# EasyEDA schematic SCH_nb_v2_2022-07-07.json
TITLE: Sheet_1; REV: 1.0; Date: 2022-05-18; Sheet: 1/1; Drawn By: LeeSophia; Company: Your Company
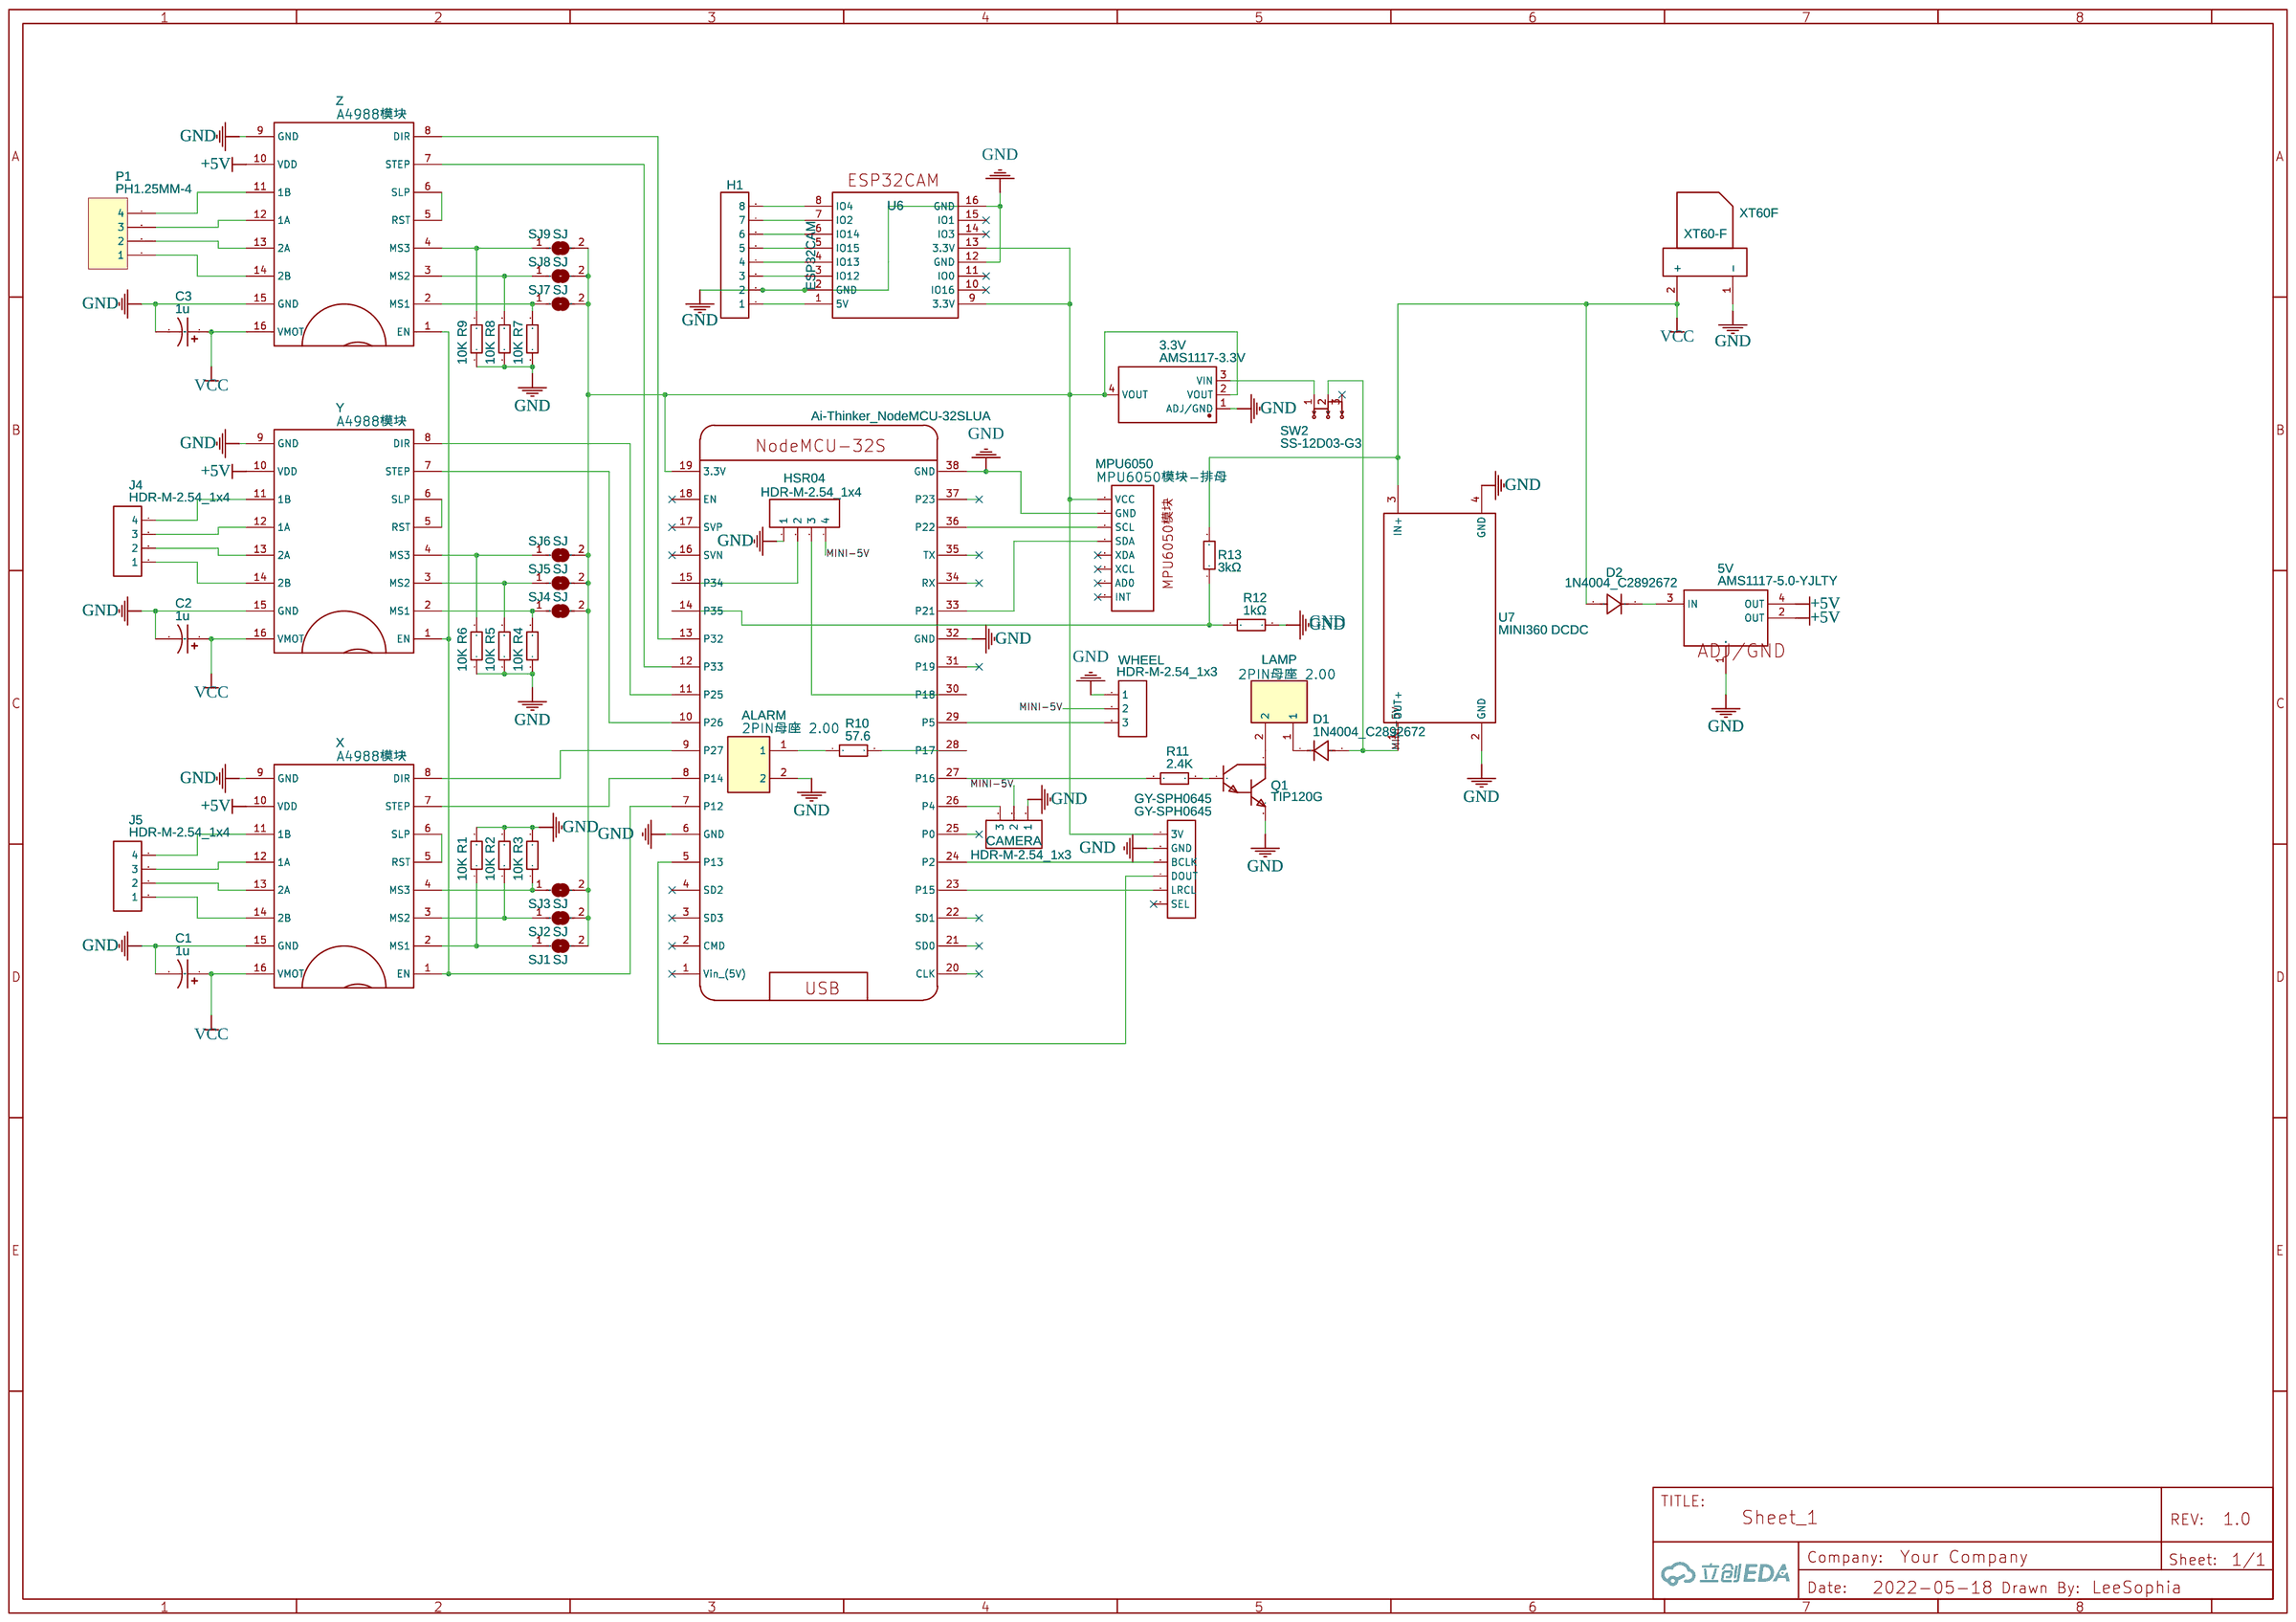
[diagram p0: schematic sheet]

## Parts
3.3V  AMS1117-3.3V  [SOT-223-4_L6.5-W3.5-P2.30-LS7.0-BR]
5V  AMS1117-5.0-YJLTY  [SOT-223-3_L6.7-W3.7-P2.30-LS7.0-BR]
ALARM  2PIN母座 2.00  [CONN-TH_2P-P2.00_PH-2A_C2319]
C1  1u  [CAP-D6.3×F2.5]
C2  1u  [CAP-D6.3×F2.5]
C3  1u  [CAP-D6.3×F2.5]
CAMERA  HDR-M-2.54_1x3  [HDR-M-2.54_1X3]
D1  1N4004_C2892672  [SMA_L4.3-W2.6-LS5.1-RD]
D2  1N4004_C2892672  [SMA_L4.3-W2.6-LS5.1-RD]
GY-SPH0645  GY-SPH0645  [HDR-F-2.54_1X6]
H1  H1  [HDR-F-2.54_1X8]
HSR04  HDR-M-2.54_1x4  [HDR-M-2.54_1X4]
J4  HDR-M-2.54_1x4  [HDR-M-2.54_1X4]
J5  HDR-M-2.54_1x4  [HDR-M-2.54_1X4]
LAMP  2PIN母座 2.00  [CONN-TH_2P-P2.00_PH-2A_C2319]
MPU6050  MPU6050模块-排母  [MPU6050模块-排母-PCB]
P1  PH1.25MM-4  [PH1.25MM-4]
Q1  TIP120G  [TO-220-3_L10.0-W4.5-P2.54-L]
R1  10K  [R0603]
R2  10K  [R0603]
R3  10K  [R0603]
R4  10K  [R0603]
R5  10K  [R0603]
R6  10K  [R0603]
R7  10K  [R0603]
R8  10K  [R0603]
R9  10K  [R0603]
R10  57.6  [R0603]
R11  2.4K  [R0603]
R12  1kΩ  [R0603]
R13  3kΩ  [R0603]
SJ1  SJ  [SJ]
SJ2  SJ  [SJ]
SJ3  SJ  [SJ]
SJ4  SJ  [SJ]
SJ5  SJ  [SJ]
SJ6  SJ  [SJ]
SJ7  SJ  [SJ]
SJ8  SJ  [SJ]
SJ9  SJ  [SJ]
SW2  SS-12D03-G3  [SW-TH_SS-12D03-G3]
U2  Ai-Thinker_NodeMCU-32SLUA  [AI-THINKER_NODEMCU-32SLUA]
U6  ESP32CAM  [ESP32CAMPCB]
U7  MINI360 DCDC  [MINI360]
WHEEL  HDR-M-2.54_1x3  [HDR-M-2.54_1X3]
X  A4988模块  [A4988]
XT60F  XT60-F  [XT60PB-F]
Y  A4988模块  [A4988]
Z  A4988模块  [A4988]

## Library data of the parts
3.3V = AMS1117-3.3V: Supplier: LCSC; Supplier Part: C2688239; Manufacturer: WPMtek(维攀微); Contributor: LCSC; JLCPCB Part Class: Extended Part
5V = AMS1117-5.0-YJLTY: Supplier: LCSC; Supplier Part: C9900020131; Manufacturer: null; JLCPCB Part Class: Extended Part; Contributor: lcsc
ALARM LAMP = 2PIN母座 2.00: Supplier: LCSC; Manufacturer: BOOMELE; Manufacturer Part: PH-2A; Supplier Part: C2319
C1-C3 = CE_TH_D6.3×F2.5_US: Contributor: LCEDA_Lib
CAMERA WHEEL = HDR-M-2.54_1x3: Supplier Part: C180248; Supplier: LCSC; Contributor: LCEDA_Lib
D1 D2 = 1N4004_C2892672: Supplier: LCSC; Supplier Part: C2892672; Manufacturer: YONGYUTAI(永裕泰); Manufacturer Part: 1N4004; JLCPCB Part Class: Extended Part; Contributor: LCSC
GY-SPH0645 = HDR-F-2.54_1x6: Supplier Part: C40877; Supplier: LCSC; Contributor: LCEDA_Lib
H1 = HDR-F-2.54_1x8: Supplier Part: C225505; Supplier: LCSC; Contributor: LCEDA_Lib
HSR04 J4 J5 = HDR-M-2.54_1x4: Supplier Part: C124378; Supplier: LCSC; Contributor: LCEDA_Lib
MPU6050 = MPU6050模块-排母: Contributor: W429367425
P1 = PH1.25MM-4: Contributor: junly
Q1 = TIP120G: Supplier: LCSC; Supplier Part: C223613; Manufacturer: ON Semicon; Contributor: LCSC; JLCPCB Part Class: Extended Part
R1-R9 = RMCF0603JT10K0: Supplier: LCSC; Supplier Part: C238881; Manufacturer: Stackpole Elec; Contributor: LCSC; JLCPCB Part Class: Extended Part
R10 = RC0603FR-0757R6L: Supplier: LCSC; Supplier Part: C245984; Manufacturer: YAGEO; Contributor: LCSC; JLCPCB Part Class: Extended Part; Resistance: 57.6Ω
R11 = AC0603FR-072K4L: Supplier: LCSC; Manufacturer: YAGEO; Contributor: LCSC; Supplier Part: C144674; JLCPCB Part Class: Extended Part; Resistance: 2.4kΩ
R12 = 0603WAF1101T5E: Supplier: LCSC; Manufacturer: UniOhm; Supplier Part: C22764; Resistance (Ohms): 1.1K; JLCPCB Part Class: Basic Part
R13 = RM06FTN3001: Supplier: LCSC; Manufacturer: TA-I; Resistance (Ohms): 3K; Contributor: LCSC; Supplier Part: C147818; JLCPCB Part Class: Extended Part
SJ1-SJ9 = SJ: Contributor: Zealot
SW2 = SS-12D03-G3: Supplier: LCSC; Supplier Part: C698224; Manufacturer: USAKRO; Contributor: LCSC; JLCPCB Part Class: Extended Part
U2 = Ai-Thinker_NodeMCU-32SLUA: Supplier: LCSC; Supplier Part: C111436; Manufacturer: Ai-Thinker; Manufacturer Part: NodeMCU-32SLua; Contributor: jobsonp checked by LCSC
U6 = ESP32CAM: Supplier: 淘宝; Contributor: Richardo
U7 = MINI360 DCDC: Contributor: libc0607
X Y Z = A4988模块: Contributor: hdf494424160
XT60F = XT60-F: Contributor: ZhangYonghui

## Nets
+5V: 5V.2(OUT) 5V.4(OUT) X.10(VDD) Y.10(VDD) Z.10(VDD)
GND: 3.3V.1(ADJ/GND) 5V.1(ADJ/GND) ALARM.2 C1.2 C2.2 C3.2 CAMERA.1 GY-SPH0645.2(GND) H1.2 HSR04.1 MPU6050.2(GND) Q1.3(E) R1.2 R2.2 R3.2 R4.1 R5.1 R6.1 R7.1 R8.1 R9.1 R12.2 U2.6(GND) U2.32(GND) U2.38(GND) U6.2(GND) U6.12(GND) U6.16(GND) U7.2(GND) U7.4(GND) WHEEL.1 X.9(GND) X.15(GND) XT60F.1(-) Y.9(GND) Y.15(GND) Z.9(GND) Z.15(GND)
VCC: C1.1 C2.1 C3.1 D2.2(A) R13.2 U7.3(IN+) X.16(VMOT) XT60F.2(+) Y.16(VMOT) Z.16(VMOT)
MINI-5V: CAMERA.2 D1.2(A) HSR04.4 SW2.2 U7.1(OUT+) WHEEL.2
Net-(3.3V-2): 3.3V.2(VOUT) 3.3V.4(VOUT) GY-SPH0645.1(3V) MPU6050.1(VCC) SJ1.2 SJ2.2 SJ3.2 SJ4.2 SJ5.2 SJ6.2 SJ7.2 SJ8.2 SJ9.2 U2.19(3.3V) U6.9(3.3V) U6.13(3.3V)
Net-(3.3V-3): 3.3V.3(VIN) SW2.1
Net-(5V-3): 5V.3(IN) D2.1(K)
Net-(ALARM-1): ALARM.1 R10.1
Net-(CAMERA-3): CAMERA.3 U2.26(P4)
Net-(D1-1): D1.1(K) LAMP.1
Net-(GY-SPH0645-3): GY-SPH0645.3(BCLK) U2.24(P2)
Net-(GY-SPH0645-4): GY-SPH0645.4(DOUT) U2.5(P13)
Net-(GY-SPH0645-5): GY-SPH0645.5(LRCL) U2.23(P15)
Net-(H1-1): H1.1 U6.1(5V)
Net-(H1-3): H1.3 U6.3(IO12)
Net-(H1-4): H1.4 U6.4(IO13)
Net-(H1-5): H1.5 U6.5(IO15)
Net-(H1-6): H1.6 U6.6(IO14)
Net-(H1-7): H1.7 U6.7(IO2)
Net-(H1-8): H1.8 U6.8(IO4)
Net-(HSR04-2): HSR04.2 U2.15(P34)
Net-(HSR04-3): HSR04.3 U2.30(P18)
Net-(J4-1): J4.1 Y.14(2B)
Net-(J4-2): J4.2 Y.13(2A)
Net-(J4-3): J4.3 Y.12(1A)
Net-(J4-4): J4.4 Y.11(1B)
Net-(J5-1): J5.1 X.14(2B)
Net-(J5-2): J5.2 X.13(2A)
Net-(J5-3): J5.3 X.12(1A)
Net-(J5-4): J5.4 X.11(1B)
Net-(LAMP-2): LAMP.2 Q1.2(C)
Net-(MPU6050-3): MPU6050.3(SCL) U2.36(P22)
Net-(MPU6050-4): MPU6050.4(SDA) U2.33(P21)
Net-(P1-1): P1.1 Z.14(2B)
Net-(P1-2): P1.2 Z.13(2A)
Net-(P1-3): P1.3 Z.12(1A)
Net-(P1-4): P1.4 Z.11(1B)
Net-(Q1-1): Q1.1(B) R11.2
Net-(R1-1): R1.1 SJ1.1 X.2(MS1)
Net-(R2-1): R2.1 SJ2.1 X.3(MS2)
Net-(R3-1): R3.1 SJ3.1 X.4(MS3)
Net-(R4-2): R4.2 SJ4.1 Y.2(MS1)
Net-(R5-2): R5.2 SJ5.1 Y.3(MS2)
Net-(R6-2): R6.2 SJ6.1 Y.4(MS3)
Net-(R7-2): R7.2 SJ7.1 Z.2(MS1)
Net-(R8-2): R8.2 SJ8.1 Z.3(MS2)
Net-(R9-2): R9.2 SJ9.1 Z.4(MS3)
Net-(R10-2): R10.2 U2.28(P17)
Net-(R11-1): R11.1 U2.27(P16)
Net-(R12-1): R12.1 R13.1 U2.14(P35)
Net-(U2-7): U2.7(P12) X.1(EN) Y.1(EN) Z.1(EN)
Net-(U2-8): U2.8(P14) X.7(STEP)
Net-(U2-9): U2.9(P27) X.8(DIR)
Net-(U2-10): U2.10(P26) Y.7(STEP)
Net-(U2-11): U2.11(P25) Y.8(DIR)
Net-(U2-12): U2.12(P33) Z.7(STEP)
Net-(U2-13): U2.13(P32) Z.8(DIR)
Net-(U2-29): U2.29(P5) WHEEL.3
Net-(X-5): X.5(RST) X.6(SLP)
Net-(Y-5): Y.5(RST) Y.6(SLP)
Net-(Z-5): Z.5(RST) Z.6(SLP)

Not connected (* = marked no-connect by the designer): GY-SPH0645 6(SEL)*; MPU6050 5(XDA)* 6(XCL)* 7(AD0)* 8(INT)*; SW2 3*; U2 1(Vin (5V))* 2(CMD)* 3(SD3)* 4(SD2)* 16(SVN)* 17(SVP)* 18(EN)* 20(CLK) 21(SD0) 22(SD1) 25(P0) 31(P19) 34(RX) 35(TX) 37(P23); U6 10(IO16)* 11(IO0)* 14(IO3)* 15(IO1)*

## Notes on the sheet
- GND
